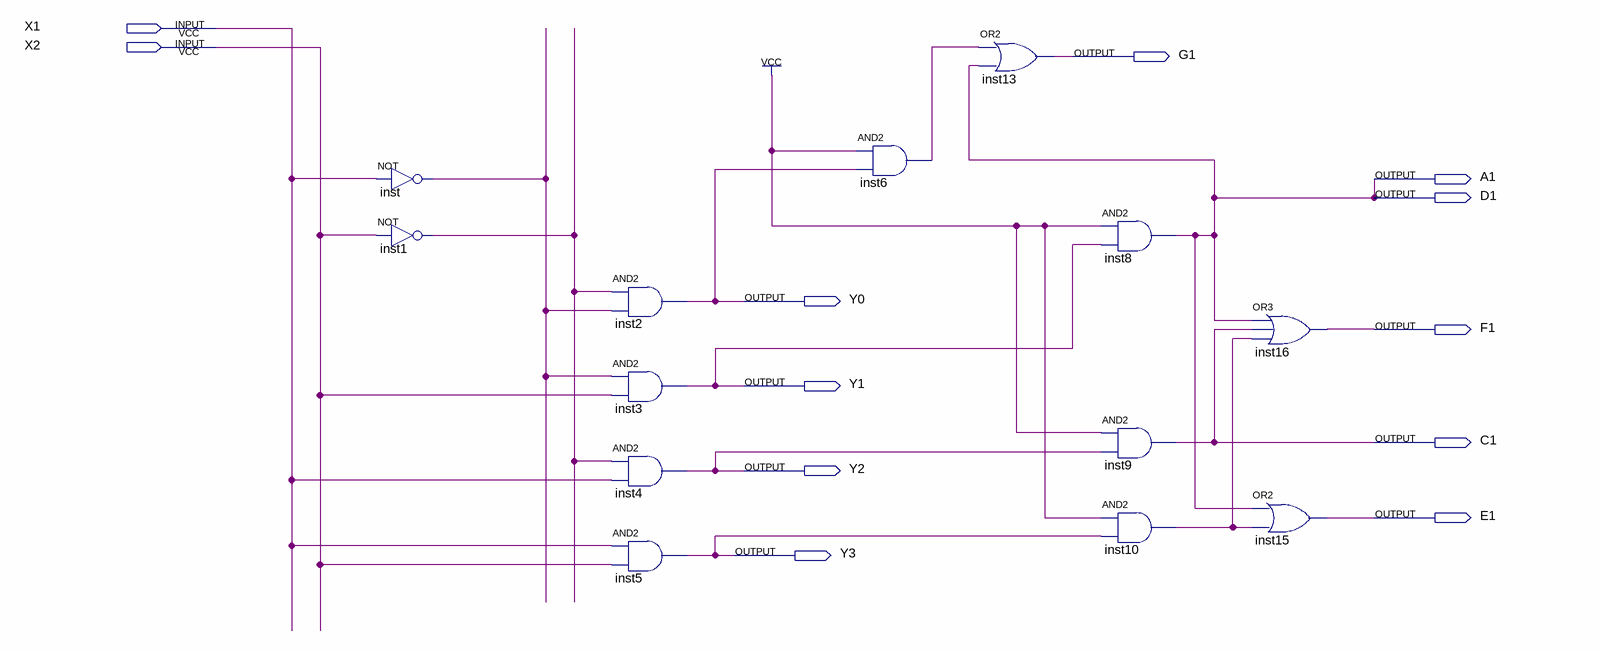
[diagram p0: schematic sheet]
// Quartus schematic Cmb1.bdf as structural Verilog: 13 symbols, 12 pins
module Cmb1 (
  input  X1,
  input  X2,
  output G1,
  output A1,
  output D1,
  output Y0,
  output F1,
  output Y1,
  output C1,
  output Y2,
  output E1,
  output Y3
);

  wire inst1_out, inst6_out, inst10_out, inst_out;

  not inst (inst_out, X1);
  not inst1 (inst1_out, X2);
  and inst2 (Y0, inst1_out, inst_out);
  and inst3 (Y1, inst_out, X2);
  and inst4 (Y2, inst1_out, X1);
  and inst5 (Y3, X1, X2);
  and inst6 (inst6_out, 1'b1, Y0);
  or inst13 (G1, inst6_out, A1);
  and inst8 (A1, 1'b1, Y1);
  and inst9 (C1, 1'b1, Y2);
  and inst10 (inst10_out, 1'b1, Y3);
  or inst16 (F1, A1, C1, inst10_out);
  or inst15 (E1, A1, inst10_out);

  assign D1 = A1;
endmodule
